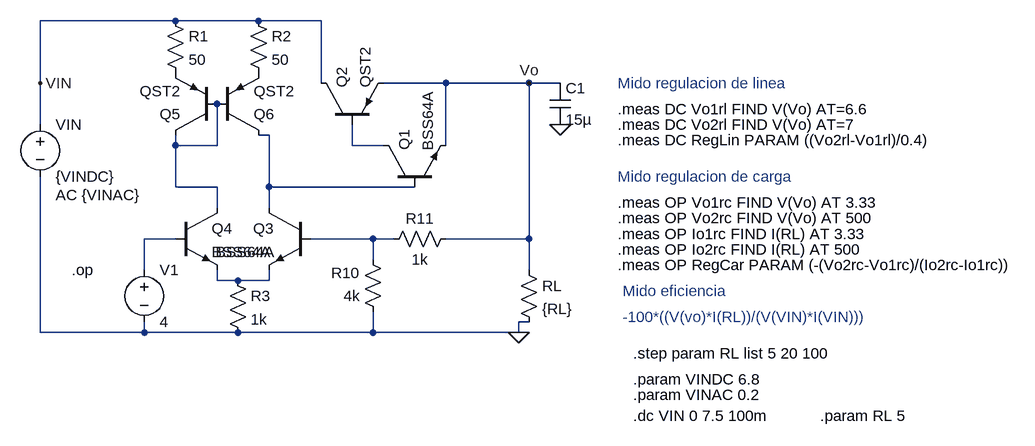
[diagram p0: schematic Regulador_lineal_version1.asc]
Regulador_lineal_version1.asc, the LTspice schematic file:
Version 4
SHEET 1 1432 680
WIRE 32 -32 -176 -32
WIRE 160 -32 32 -32
WIRE 256 -32 160 -32
WIRE -176 64 -176 -32
WIRE 256 64 256 -32
WIRE 448 64 352 64
WIRE 576 64 448 64
WIRE 624 64 576 64
WIRE -176 128 -176 64
WIRE 176 144 160 144
WIRE 32 160 32 144
WIRE 96 160 96 96
WIRE 96 160 32 160
WIRE 304 160 304 128
WIRE 352 160 304 160
WIRE 448 160 448 64
WIRE 32 224 32 160
WIRE 96 224 32 224
WIRE 176 224 176 144
WIRE 400 224 176 224
WIRE 96 256 96 224
WIRE 176 256 176 224
WIRE 32 304 -16 304
WIRE 336 304 240 304
WIRE 368 304 336 304
WIRE 576 304 576 64
WIRE 576 304 448 304
WIRE 336 336 336 304
WIRE -16 352 -16 304
WIRE 576 352 576 304
WIRE 96 368 96 352
WIRE 128 368 96 368
WIRE 176 368 176 352
WIRE 176 368 128 368
WIRE 576 432 560 432
WIRE -176 448 -176 208
WIRE -16 448 -16 432
WIRE -16 448 -176 448
WIRE 128 448 -16 448
WIRE 336 448 336 416
WIRE 336 448 128 448
WIRE 560 448 560 432
WIRE 560 448 336 448
FLAG 560 448 0
FLAG -176 64 VIN
FLAG 576 64 Vo
FLAG 624 128 0
SYMBOL voltage -176 112 R0
WINDOW 123 24 124 Left 2
WINDOW 39 0 0 Left 0
SYMATTR Value2 AC {VINAC}
SYMATTR InstName VIN
SYMATTR Value {VINDC}
SYMBOL res 560 336 R0
SYMATTR InstName RL
SYMATTR Value {RL}
SYMBOL npn 352 224 R270
SYMATTR InstName Q1
SYMATTR Value BSS64A
SYMBOL pnp 256 128 R270
SYMATTR InstName Q2
SYMATTR Value QST2
SYMBOL res 464 288 R90
WINDOW 0 0 56 VBottom 2
WINDOW 3 32 56 VTop 2
SYMATTR InstName R11
SYMATTR Value 1k
SYMBOL res 352 432 R180
WINDOW 0 36 76 Left 2
WINDOW 3 36 40 Left 2
SYMATTR InstName R10
SYMATTR Value 4k
SYMBOL npn 240 256 M0
SYMATTR InstName Q3
SYMATTR Value BSS64A
SYMBOL npn 32 256 R0
SYMATTR InstName Q4
SYMATTR Value BSS64A
SYMBOL voltage -16 336 R0
WINDOW 123 0 0 Left 0
WINDOW 39 0 0 Left 0
SYMATTR InstName V1
SYMATTR Value 4
SYMBOL pnp 96 144 R180
SYMATTR InstName Q5
SYMATTR Value QST2
SYMBOL pnp 96 144 M180
SYMATTR InstName Q6
SYMATTR Value QST2
SYMBOL res 16 -48 R0
SYMATTR InstName R1
SYMATTR Value 50
SYMBOL res 144 -48 R0
SYMATTR InstName R2
SYMATTR Value 50
SYMBOL res 112 352 R0
SYMATTR InstName R3
SYMATTR Value 1k
SYMBOL cap 608 64 R0
SYMATTR InstName C1
SYMATTR Value 15µ
TEXT -128 352 Left 2 !.op
TEXT 736 576 Left 2 !.dc VIN 0 7.5 100m
TEXT 736 520 Left 2 !.param VINDC 6.8
TEXT 736 544 Left 2 !.param VINAC 0.2
TEXT 1024 576 Left 2 !.param RL 5
TEXT 736 480 Left 2 !.step param RL list 5 20 100
TEXT 712 64 Left 2 ;Mido regulacion de linea
TEXT 712 104 Left 2 !.meas DC Vo1rl FIND V(Vo) AT=6.6
TEXT 712 128 Left 2 !.meas DC Vo2rl FIND V(Vo) AT=7
TEXT 712 152 Left 2 !.meas DC RegLin PARAM ((Vo2rl-Vo1rl)/0.4)
TEXT 712 208 Left 2 ;Mido regulacion de carga
TEXT 712 248 Left 2 !.meas OP Vo1rc FIND V(Vo) AT 3.33
TEXT 712 272 Left 2 !.meas OP Vo2rc FIND V(Vo) AT 500
TEXT 712 344 Left 2 !.meas OP RegCar PARAM (-(Vo2rc-Vo1rc)/(Io2rc-Io1rc))
TEXT 712 296 Left 2 !.meas OP Io1rc FIND I(RL) AT 3.33
TEXT 712 320 Left 2 !.meas OP Io2rc FIND I(RL) AT 500
TEXT 720 384 Left 2 ;Mido eficiencia
TEXT 720 424 Left 2 ;-100*((V(vo)*I(RL))/(V(VIN)*I(VIN)))

The netlist it stands for:
* Regulador_lineal_version1.asc
VIN VIN 0 {VINDC} AC {VINAC}
RL Vo 0 {RL}
Q1 N003 N001 Vo 0 BSS64A
Q2 VIN N003 Vo 0 QST2
R11 Vo N005 1k
R10 0 N005 4k
Q3 N001 N005 N006 0 BSS64A
Q4 N002 N004 N006 0 BSS64A
V1 N004 0 4
Q5 N002 N002 P001 0 QST2
Q6 N001 N002 P002 0 QST2
R1 VIN P001 50
R2 VIN P002 50
R3 N006 0 1k
C1 Vo 0 15µ
.model NPN NPN
.model PNP PNP
.lib standard.bjt
.op
.dc VIN 0 7.5 100m
.param VINDC 6.8
.param VINAC 0.2
.param RL 5
.step param RL list 5 20 100
* Mido regulacion de linea
.meas DC Vo1rl FIND V(Vo) AT=6.6
.meas DC Vo2rl FIND V(Vo) AT=7
.meas DC RegLin PARAM ((Vo2rl-Vo1rl)/0.4)
* Mido regulacion de carga
.meas OP Vo1rc FIND V(Vo) AT 3.33
.meas OP Vo2rc FIND V(Vo) AT 500
.meas OP RegCar PARAM (-(Vo2rc-Vo1rc)/(Io2rc-Io1rc))
.meas OP Io1rc FIND I(RL) AT 3.33
.meas OP Io2rc FIND I(RL) AT 500
* Mido eficiencia
* -100*((V(vo)*I(RL))/(V(VIN)*I(VIN)))
.backanno
.end